# EAGLE schematic CPU-001 (EAGLE 9.5.2)

## Sheet 1 of 6
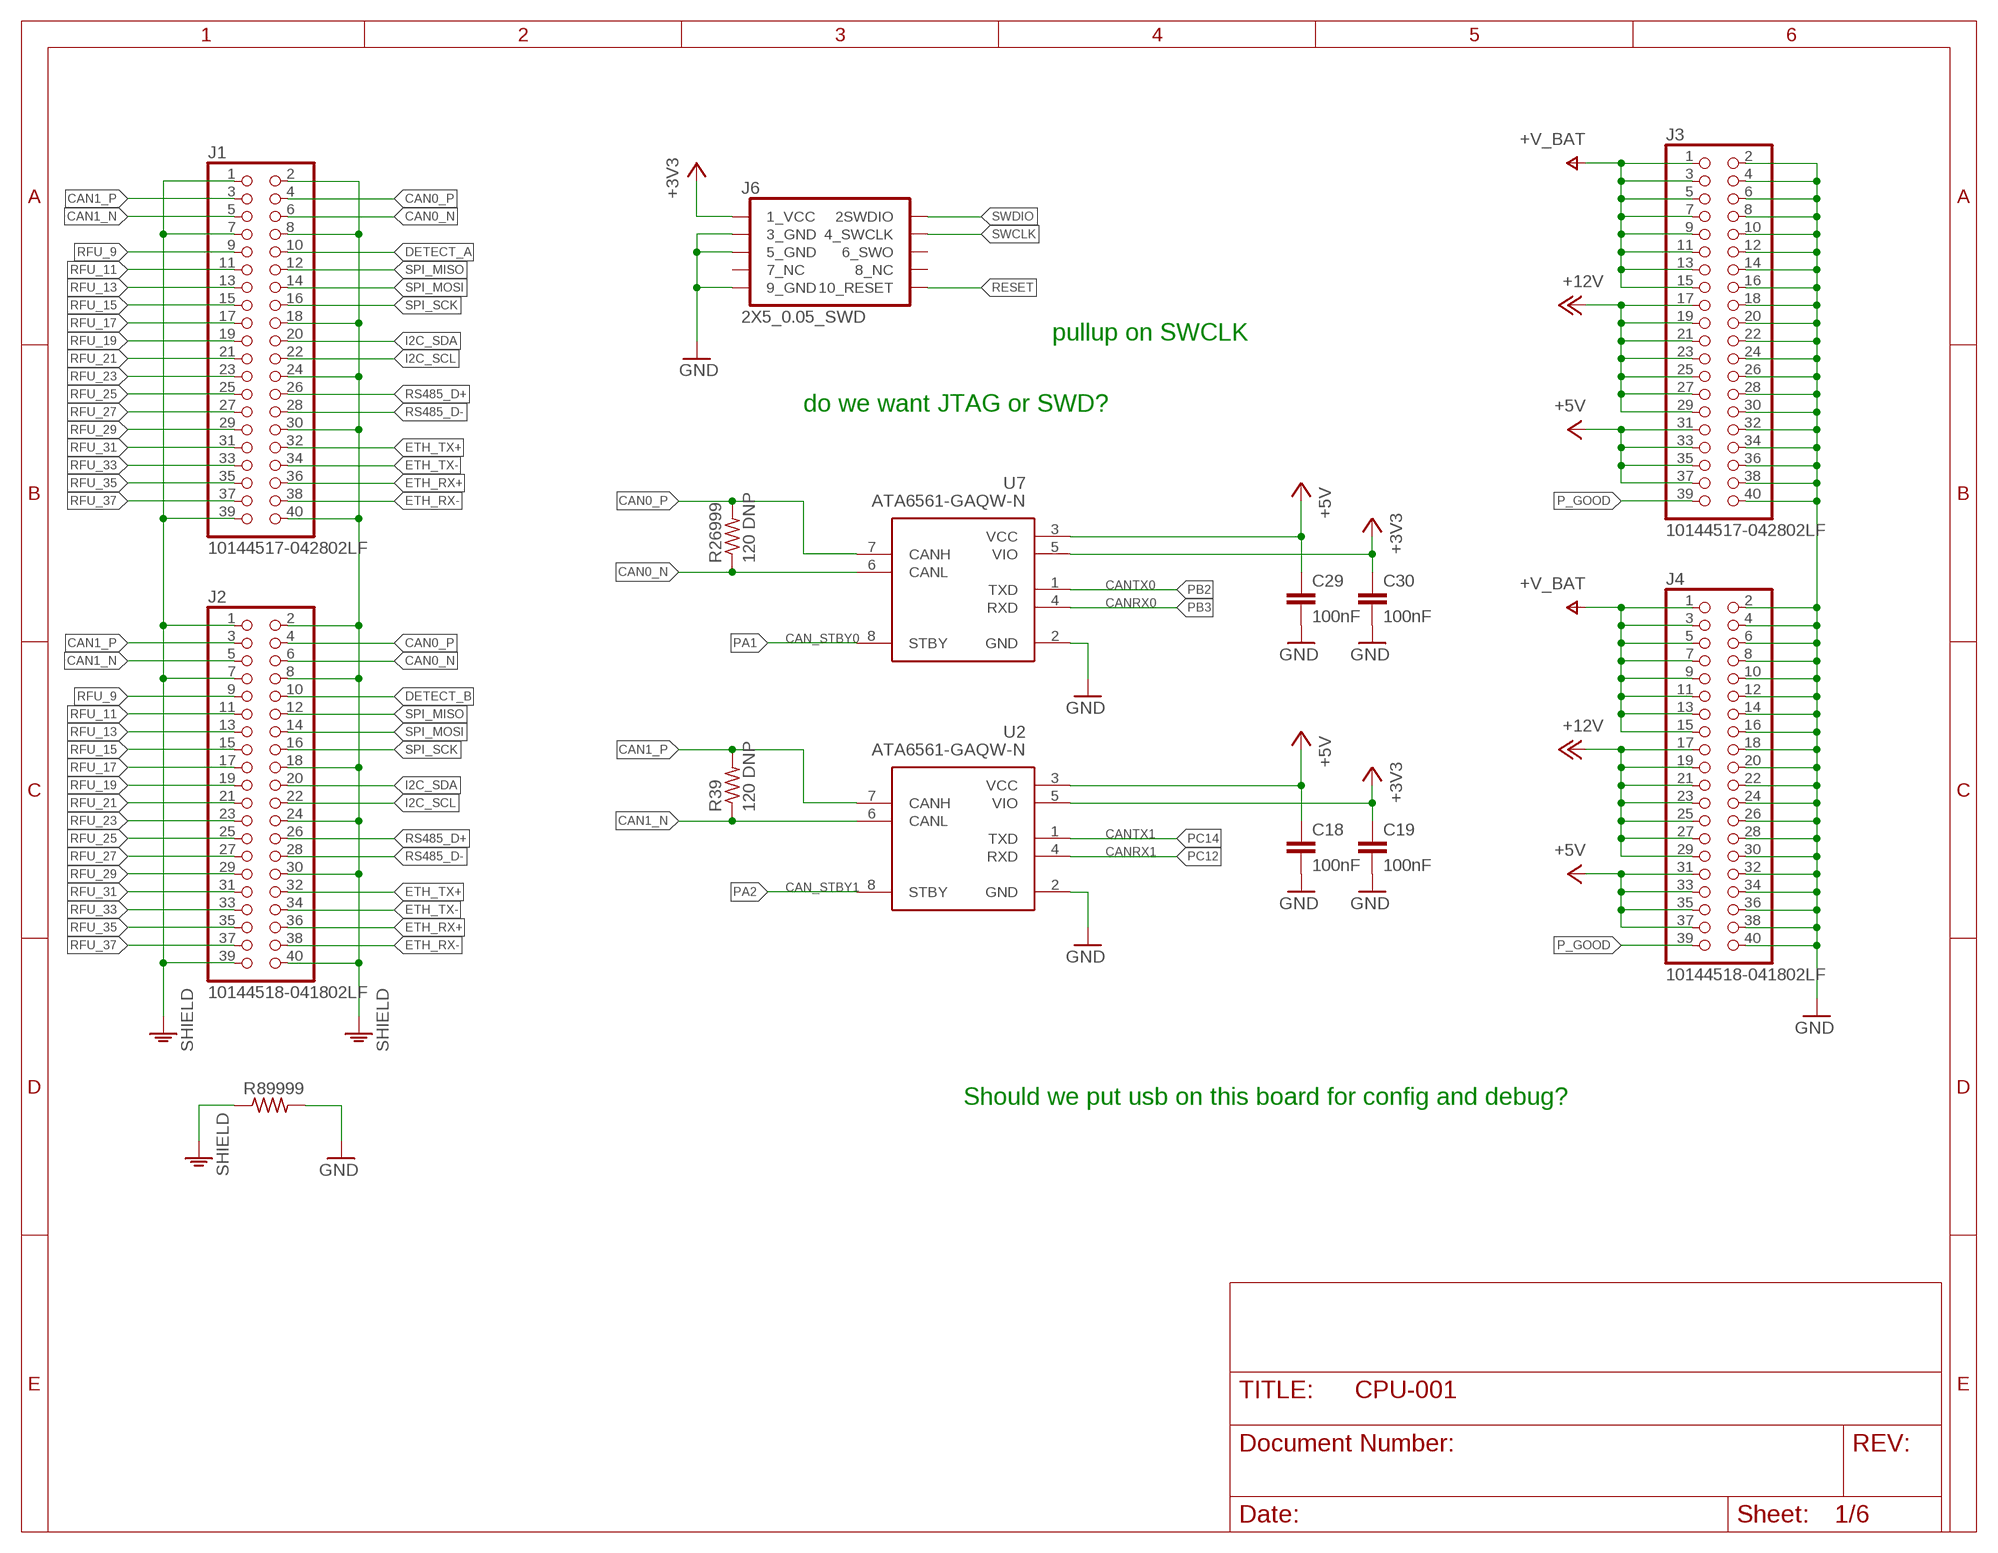
[diagram p0: schematic, sheet 1]

### Parts
C18  100nF  C-EUC0402  [C0402]
C19  100nF  C-EUC0402  [C0402]
C29  100nF  C-EUC0402  [C0402]
C30  100nF  C-EUC0402  [C0402]
J1  10144517-042802LF  [10144517-042802LF]
J2  10144518-041802LF  [10144518-041802LF]
J3  10144517-042802LF  [10144517-042802LF]
J4  10144518-041802LF  [10144518-041802LF]
J6  2X5_0.05_SWD  [2X5_RIGHT]
R39  120 DNP  R-US_R0402  [R0402]
R26999  120 DNP  R-US_R0402  [R0402]
R89999  R-US_R0402  [R0402]
U2  ATA6561-GAQW-N  [SOIC127P600X175-8N]
U7  ATA6561-GAQW-N  [SOIC127P600X175-8N]

### Nets
+3V3: C19.1 C30.1 J6.1(1_VCC) U2.5(VIO) U7.5(VIO) ; also sheet 2,4,5,6
+5V: C18.1 C29.1 J3.31 J3.33 J3.35 J3.37 J4.31 J4.33 J4.35 J4.37 U2.3(VCC) U7.3(VCC) ; also sheet 2
+12V: J3.17 J3.19 J3.21 J3.23 J3.25 J3.27 J3.29 J4.17 J4.19 J4.21 J4.23 J4.25 J4.27 J4.29
+V_BAT: J3.1 J3.3 J3.5 J3.7 J3.9 J3.11 J3.13 J3.15 J4.1 J4.3 J4.5 J4.7 J4.9 J4.11 J4.13 J4.15
CAN0_N: J1.6 J2.6 R26999.1 U7.6(CANL)
CAN0_P: J1.4 J2.4 R26999.2 U7.7(CANH)
CAN1_N: J1.5 J2.5 R39.1 U2.6(CANL)
CAN1_P: J1.3 J2.3 R39.2 U2.7(CANH)
DETECT_A: J1.10
DETECT_B: J2.10
ETH_RX+: J1.36 J2.36
ETH_RX-: J1.38 J2.38
ETH_TX+: J1.32 J2.32
ETH_TX-: J1.34 J2.34
GND: C18.2 C19.2 C29.2 C30.2 J3.2 J3.4 J3.6 J3.8 J3.10 J3.12 J3.14 J3.16 J3.18 J3.20 J3.22 J3.24 J3.26 J3.28 J3.30 J3.32 J3.34 J3.36 J3.38 J3.40 J4.2 J4.4 J4.6 J4.8 J4.10 J4.12 J4.14 J4.16 J4.18 J4.20 J4.22 J4.24 J4.26 J4.28 J4.30 J4.32 J4.34 J4.36 J4.38 J4.40 J6.3(3_GND) J6.5(5_GND) J6.9(9_GND) R89999.2 U2.2(GND) U7.2(GND) ; also sheet 2,4,5,6
I2C_SCL: J1.22 J2.22
I2C_SDA: J1.20 J2.20
P_GOOD: J3.39 J4.39
PA1: U7.8(STBY) ; also sheet 3
PA2: U2.8(STBY) ; also sheet 3
PB2: U7.1(TXD) ; also sheet 3
PB3: U7.4(RXD) ; also sheet 3
PC12: U2.4(RXD) ; also sheet 3
PC14: U2.1(TXD) ; also sheet 3
RESET: J6.10(10_RESET)
RFU_9: J1.9 J2.9
RFU_11: J1.11 J2.11
RFU_13: J1.13 J2.13
RFU_15: J1.15 J2.15
RFU_17: J1.17 J2.17
RFU_19: J1.19 J2.19
RFU_21: J1.21 J2.21
RFU_23: J1.23 J2.23
RFU_25: J1.25 J2.25
RFU_27: J1.27 J2.27
RFU_29: J1.29 J2.29
RFU_31: J1.31 J2.31
RFU_33: J1.33 J2.33
RFU_35: J1.35 J2.35
RFU_37: J1.37 J2.37
RS485_D+: J1.26 J2.26
RS485_D-: J1.28 J2.28
SHIELD: J1.1 J1.2 J1.7 J1.8 J1.18 J1.24 J1.30 J1.39 J1.40 J2.1 J2.2 J2.7 J2.8 J2.18 J2.24 J2.30 J2.39 J2.40 R89999.1
SPI_MISO: J1.12 J2.12
SPI_MOSI: J1.14 J2.14
SPI_SCK: J1.16 J2.16
SWCLK: J6.4(4_SWCLK)
SWDIO: J6.2(2SWDIO)
Unconnected: J6.6(6_SWO) J6.7(7_NC) J6.8(8_NC)

### Notes on the sheet
- pullup on SWCLK
- do we want JTAG or SWD?
- CANTX0
- CANRX0
- CAN_STBY0
- CANTX1
- CANRX1
- CAN_STBY1
- Should we put usb on this board for config and debug?

## Sheet 2 of 6
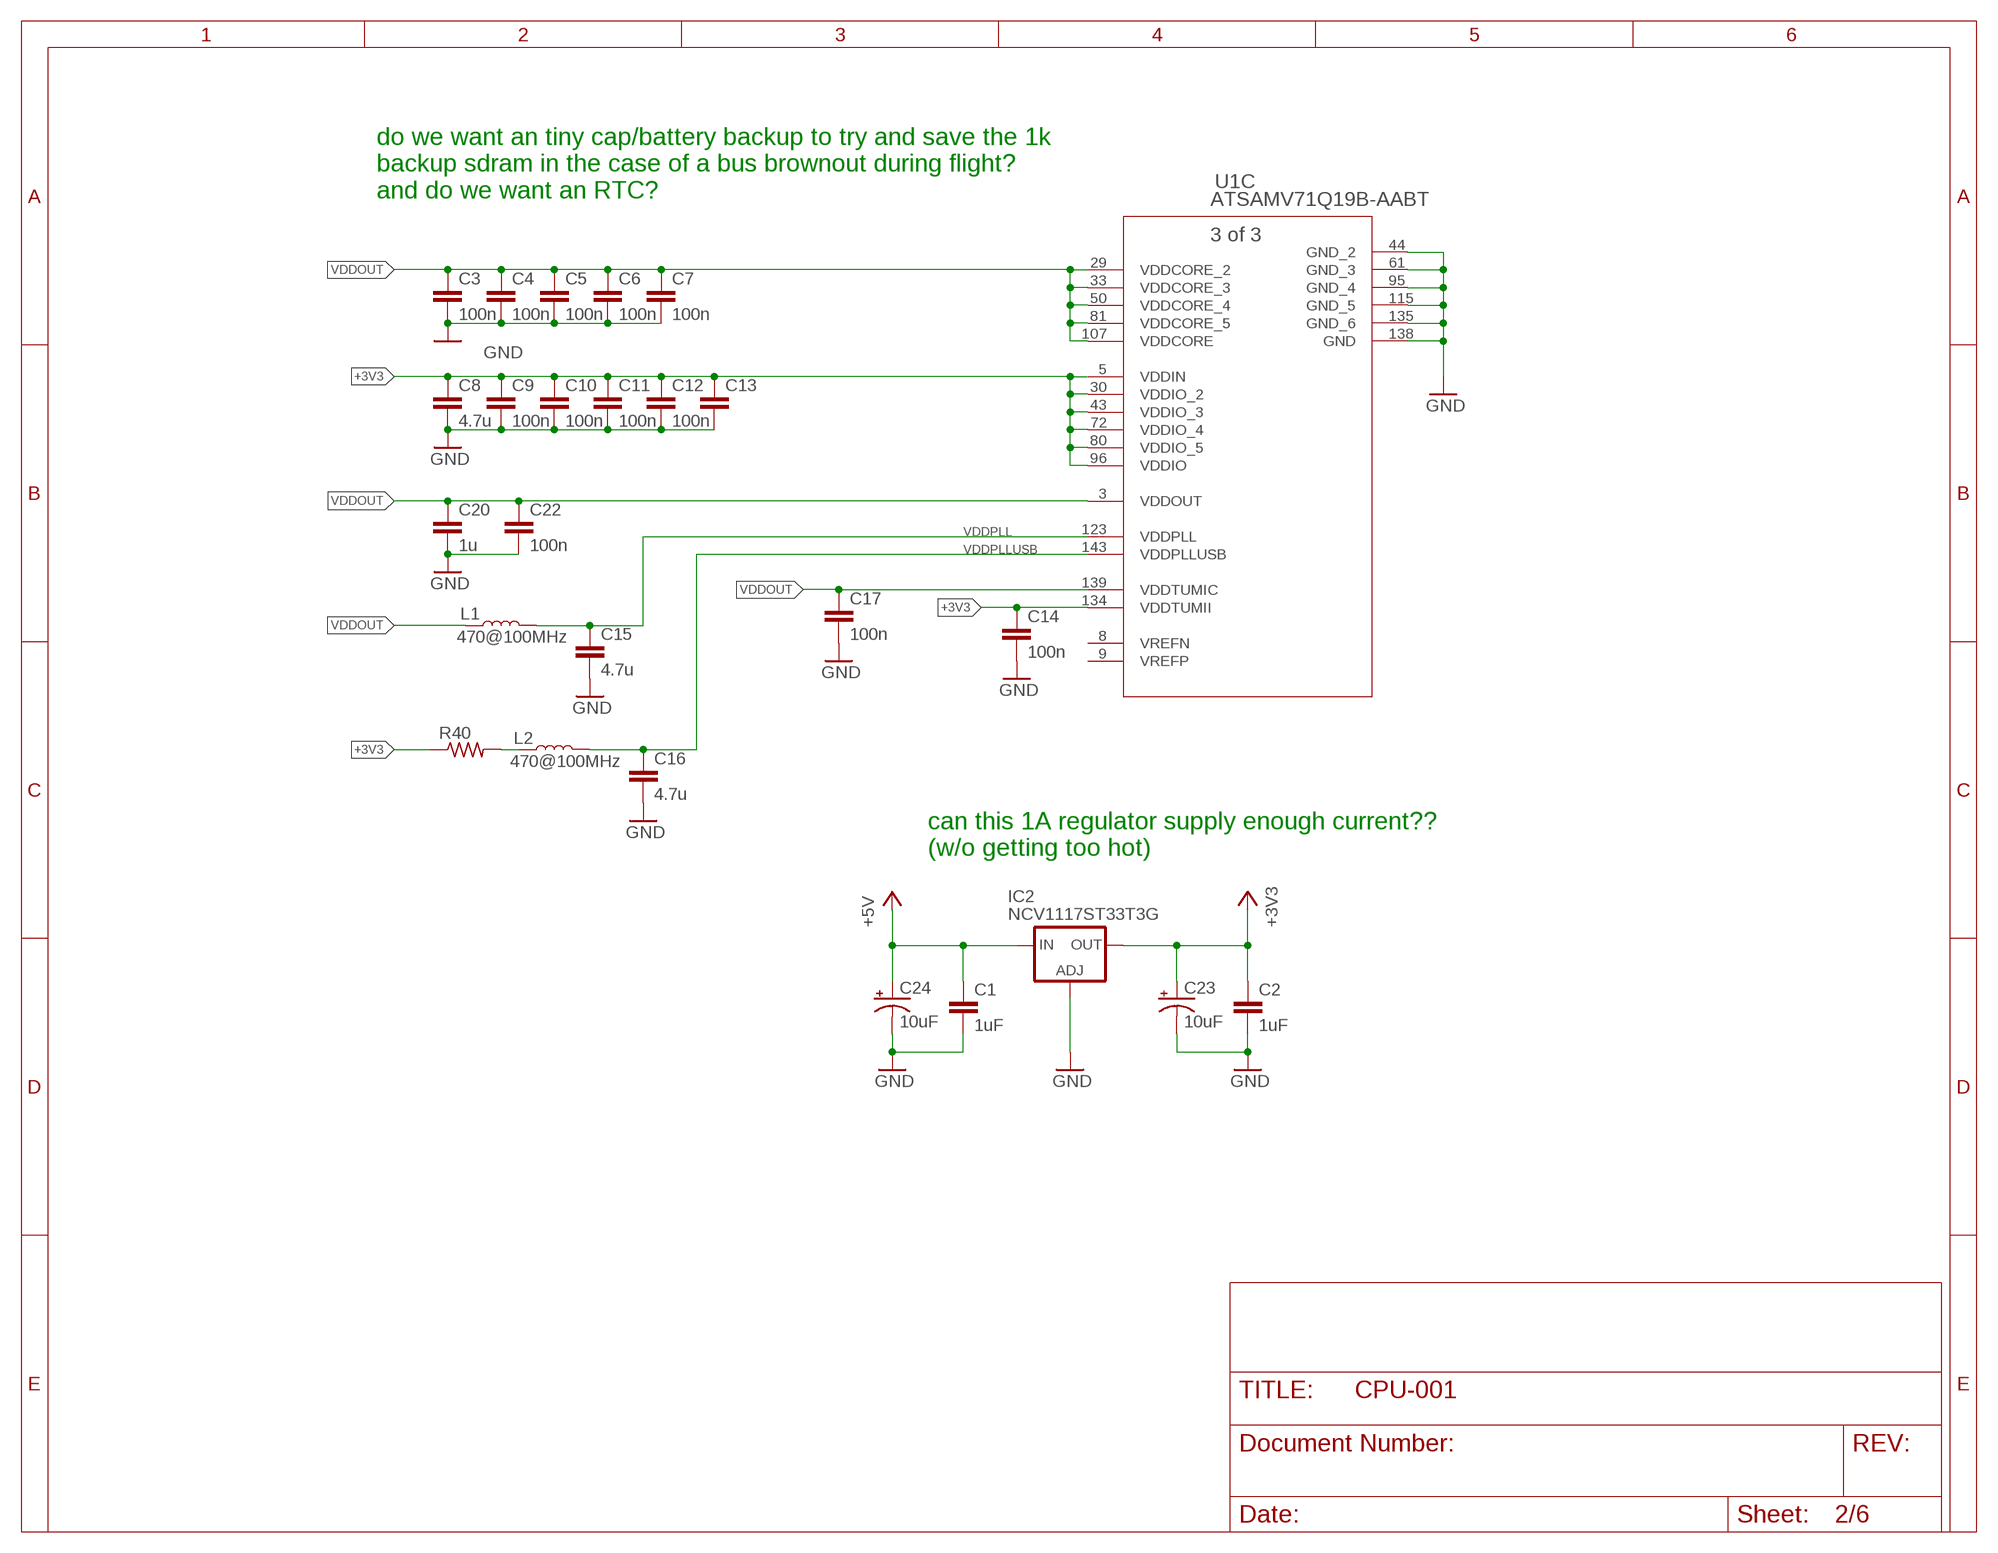
[diagram p1: schematic, sheet 2]

### Parts
C1  1uF  C-EUC0603  [C0603]
C2  1uF  C-EUC0603  [C0603]
C3  100n  C-EUC0402  [C0402]
C4  100n  C-EUC0402  [C0402]
C5  100n  C-EUC0402  [C0402]
C6  100n  C-EUC0402  [C0402]
C7  100n  C-EUC0402  [C0402]
C8  4.7u  C-EUC0805  [C0805]
C9  100n  C-EUC0402  [C0402]
C10  100n  C-EUC0402  [C0402]
C11  100n  C-EUC0402  [C0402]
C12  100n  C-EUC0402  [C0402]
C13  100n  C-EUC0402  [C0402]
C14  100n  C-EUC0402  [C0402]
C15  4.7u  C-EUC0805  [C0805]
C16  4.7u  C-EUC0805  [C0805]
C17  100n  C-EUC0402  [C0402]
C20  1u  C-EUC0402  [C0402]
C22  100n  C-EUC0402  [C0402]
C23  10uF  10UF-POLAR-0603-6.3V-20%(TANT)  [0603-POLAR]
C24  10uF  10UF-POLAR-0603-6.3V-20%(TANT)  [0603-POLAR]
IC2  NCV1117ST33T3G  LD117ASTR  [SOT223]
L1  470@100MHz  INDUCTOR-0603-33NH  [0603]
L2  470@100MHz  INDUCTOR-0603-33NH  [0603]
R40  R-US_R0402  [R0402]
U1  ATSAMV71Q19B-AABT  [LQFP144_20X20MC]

### Nets
+3V3: C2.1 C8.1 C9.1 C10.1 C11.1 C12.1 C13.1 C14.1 C23.+ IC2.4(OUT) R40.1 U1.5(C:VDDIN) U1.30(C:VDDIO_2) U1.43(C:VDDIO_3) U1.72(C:VDDIO_4) U1.80(C:VDDIO_5) U1.96(C:VDDIO) U1.134(C:VDDTUMII) ; also sheet 1,4,5,6
+5V: C1.1 C24.+ IC2.3(IN) ; also sheet 1
GND: C1.2 C2.2 C3.2 C4.2 C5.2 C6.2 C7.2 C8.2 C9.2 C10.2 C11.2 C12.2 C13.2 C14.2 C15.2 C16.2 C17.2 C20.2 C22.2 C23.- C24.- IC2.1(ADJ) U1.44(C:GND_2) U1.61(C:GND_3) U1.95(C:GND_4) U1.115(C:GND_5) U1.135(C:GND_6) U1.138(C:GND) ; also sheet 1,4,5,6
N$4: L2.1 R40.2
VDDOUT: C3.1 C4.1 C5.1 C6.1 C7.1 C17.1 C20.1 C22.1 L1.1 U1.3(C:VDDOUT) U1.29(C:VDDCORE_2) U1.33(C:VDDCORE_3) U1.50(C:VDDCORE_4) U1.81(C:VDDCORE_5) U1.107(C:VDDCORE) U1.139(C:VDDTUMIC)
VDDPLL: C15.1 L1.2 U1.123(C:VDDPLL)
VDDPLLUSB: C16.1 L2.2 U1.143(C:VDDPLLUSB)

### Notes on the sheet
- do we want an tiny cap/battery backup to try and save the 1k
  backup sdram in the case of a bus brownout during flight?
  and do we want an RTC?
- can this 1A regulator supply enough current?? 
  (w/o getting too hot)

## Sheet 3 of 6
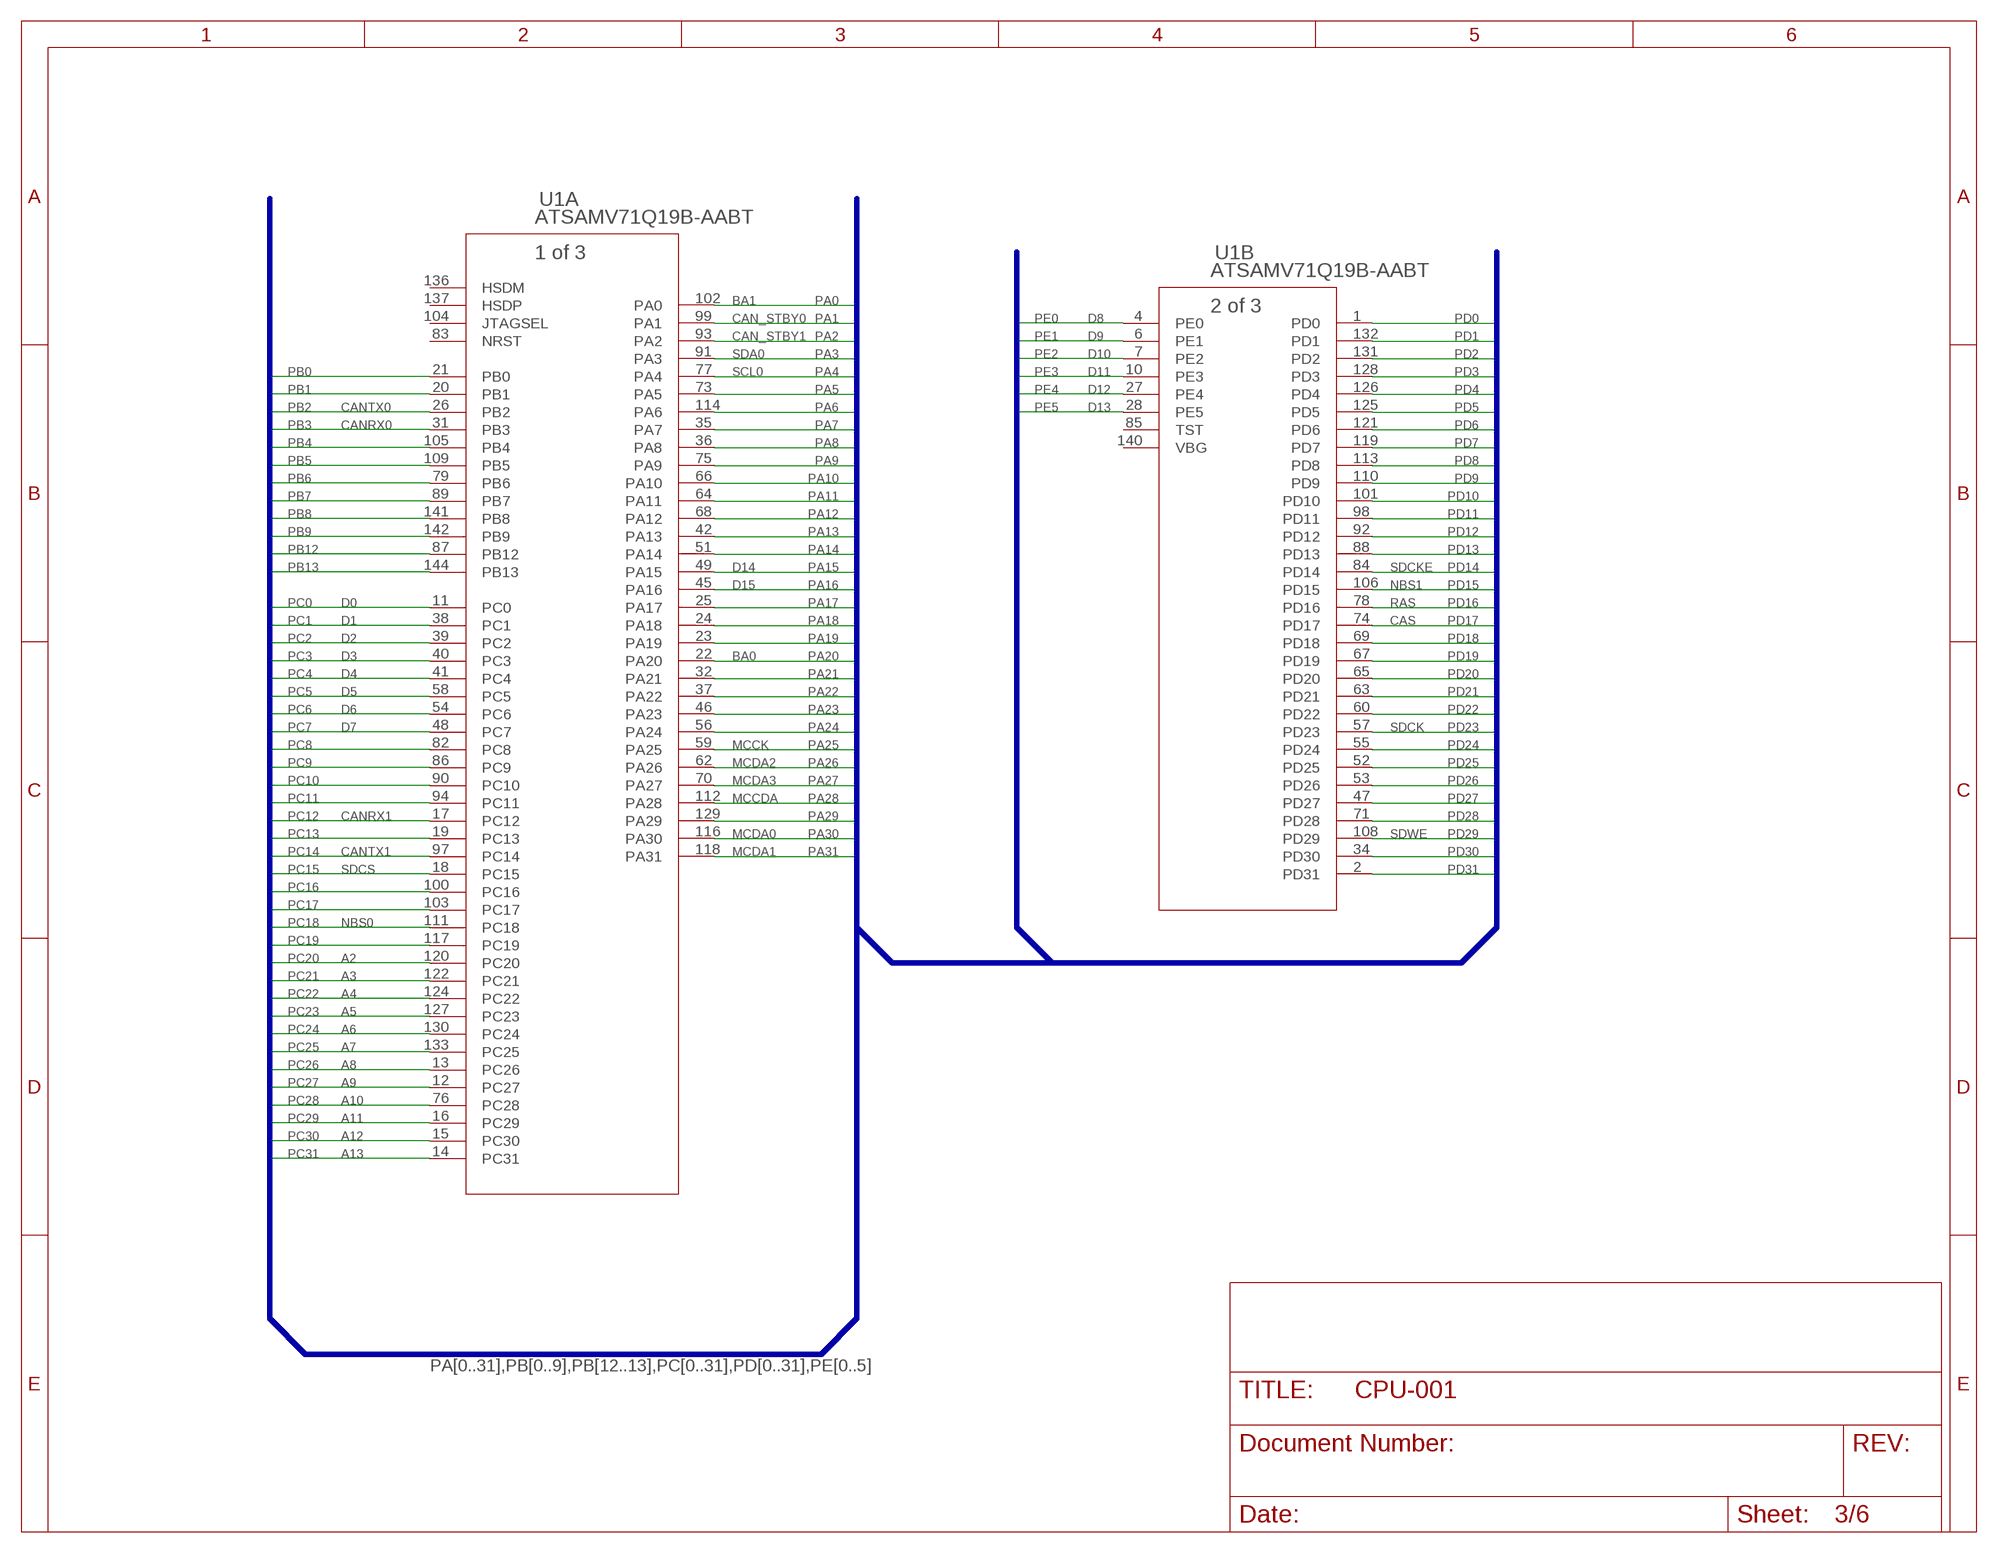
[diagram p2: schematic, sheet 3]

### Nets
PA0: U1.102(A:PA0) ; also sheet 4
PA1: U1.99(A:PA1) ; also sheet 1
PA2: U1.93(A:PA2) ; also sheet 1
PA3: U1.91(A:PA3) ; also sheet 6
PA4: U1.77(A:PA4) ; also sheet 6
PA5: U1.73(A:PA5)
PA6: U1.114(A:PA6)
PA7: U1.35(A:PA7)
PA8: U1.36(A:PA8)
PA9: U1.75(A:PA9)
PA10: U1.66(A:PA10)
PA11: U1.64(A:PA11)
PA12: U1.68(A:PA12)
PA13: U1.42(A:PA13)
PA14: U1.51(A:PA14)
PA15: U1.49(A:PA15) ; also sheet 4
PA16: U1.45(A:PA16) ; also sheet 4
PA17: U1.25(A:PA17)
PA18: U1.24(A:PA18)
PA19: U1.23(A:PA19)
PA20: U1.22(A:PA20) ; also sheet 4
PA21: U1.32(A:PA21)
PA22: U1.37(A:PA22)
PA23: U1.46(A:PA23)
PA24: U1.56(A:PA24)
PA25: U1.59(A:PA25) ; also sheet 5
PA26: U1.62(A:PA26) ; also sheet 5
PA27: U1.70(A:PA27) ; also sheet 5
PA28: U1.112(A:PA28) ; also sheet 5
PA29: U1.129(A:PA29)
PA30: U1.116(A:PA30) ; also sheet 5
PA31: U1.118(A:PA31) ; also sheet 5
PB0: U1.21(A:PB0)
PB1: U1.20(A:PB1)
PB2: U1.26(A:PB2) ; also sheet 1
PB3: U1.31(A:PB3) ; also sheet 1
PB4: U1.105(A:PB4)
PB5: U1.109(A:PB5)
PB6: U1.79(A:PB6)
PB7: U1.89(A:PB7)
PB8: U1.141(A:PB8)
PB9: U1.142(A:PB9)
PB12: U1.87(A:PB12)
PB13: U1.144(A:PB13)
PC0: U1.11(A:PC0) ; also sheet 4
PC1: U1.38(A:PC1) ; also sheet 4
PC2: U1.39(A:PC2) ; also sheet 4
PC3: U1.40(A:PC3) ; also sheet 4
PC4: U1.41(A:PC4) ; also sheet 4
PC5: U1.58(A:PC5) ; also sheet 4
PC6: U1.54(A:PC6) ; also sheet 4
PC7: U1.48(A:PC7) ; also sheet 4
PC8: U1.82(A:PC8)
PC9: U1.86(A:PC9)
PC10: U1.90(A:PC10)
PC11: U1.94(A:PC11)
PC12: U1.17(A:PC12) ; also sheet 1
PC13: U1.19(A:PC13)
PC14: U1.97(A:PC14) ; also sheet 1
PC15: U1.18(A:PC15) ; also sheet 4
PC16: U1.100(A:PC16)
PC17: U1.103(A:PC17)
PC18: U1.111(A:PC18) ; also sheet 4
PC19: U1.117(A:PC19)
PC20: U1.120(A:PC20) ; also sheet 4
PC21: U1.122(A:PC21) ; also sheet 4
PC22: U1.124(A:PC22) ; also sheet 4
PC23: U1.127(A:PC23) ; also sheet 4
PC24: U1.130(A:PC24) ; also sheet 4
PC25: U1.133(A:PC25) ; also sheet 4
PC26: U1.13(A:PC26) ; also sheet 4
PC27: U1.12(A:PC27) ; also sheet 4
PC28: U1.76(A:PC28) ; also sheet 4
PC29: U1.16(A:PC29) ; also sheet 4
PC30: U1.15(A:PC30) ; also sheet 4
PC31: U1.14(A:PC31) ; also sheet 4
PD0: U1.1(B:PD0)
PD1: U1.132(B:PD1)
PD2: U1.131(B:PD2)
PD3: U1.128(B:PD3)
PD4: U1.126(B:PD4)
PD5: U1.125(B:PD5)
PD6: U1.121(B:PD6)
PD7: U1.119(B:PD7)
PD8: U1.113(B:PD8)
PD9: U1.110(B:PD9)
PD10: U1.101(B:PD10)
PD11: U1.98(B:PD11)
PD12: U1.92(B:PD12)
PD13: U1.88(B:PD13)
PD14: U1.84(B:PD14) ; also sheet 4
PD15: U1.106(B:PD15) ; also sheet 4
PD16: U1.78(B:PD16) ; also sheet 4
PD17: U1.74(B:PD17) ; also sheet 4
PD18: U1.69(B:PD18)
PD19: U1.67(B:PD19)
PD20: U1.65(B:PD20)
PD21: U1.63(B:PD21)
PD22: U1.60(B:PD22)
PD23: U1.57(B:PD23) ; also sheet 4
PD24: U1.55(B:PD24)
PD25: U1.52(B:PD25)
PD26: U1.53(B:PD26)
PD27: U1.47(B:PD27)
PD28: U1.71(B:PD28)
PD29: U1.108(B:PD29) ; also sheet 4
PD30: U1.34(B:PD30)
PD31: U1.2(B:PD31)
PE0: U1.4(B:PE0) ; also sheet 4
PE1: U1.6(B:PE1) ; also sheet 4
PE2: U1.7(B:PE2) ; also sheet 4
PE3: U1.10(B:PE3) ; also sheet 4
PE4: U1.27(B:PE4) ; also sheet 4
PE5: U1.28(B:PE5) ; also sheet 4
Unconnected: U1.83(A:NRST) U1.85(B:TST) U1.104(A:JTAGSEL) U1.136(A:HSDM) U1.137(A:HSDP) U1.140(B:VBG)

### Buses
PA[0..31],PB[0..9],PB[12..13],PC[0..31],PD[0..31],PE[0..5]

### Notes on the sheet
- BA1
- CAN_STBY0 | D8
- CAN_STBY1 | D9
- SDA0 | D10
- SCL0 | D11
- D12
- CANTX0 | D13
- CANRX0
- D14 | SDCKE
- D15 | NBS1
- D0 | RAS
- D1 | CAS
- D2
- D3 | BA0
- D4
- D5
- D6
- D7 | SDCK
- MCCK
- MCDA2
- MCDA3
- MCCDA
- CANRX1
- MCDA0 | SDWE
- CANTX1 | MCDA1
- SDCS
- NBS0
- A2
- A3
- A4
- A5
- A6
- A7
- A8
- A9
- A10
- A11
- A12
- A13

## Sheet 4 of 6
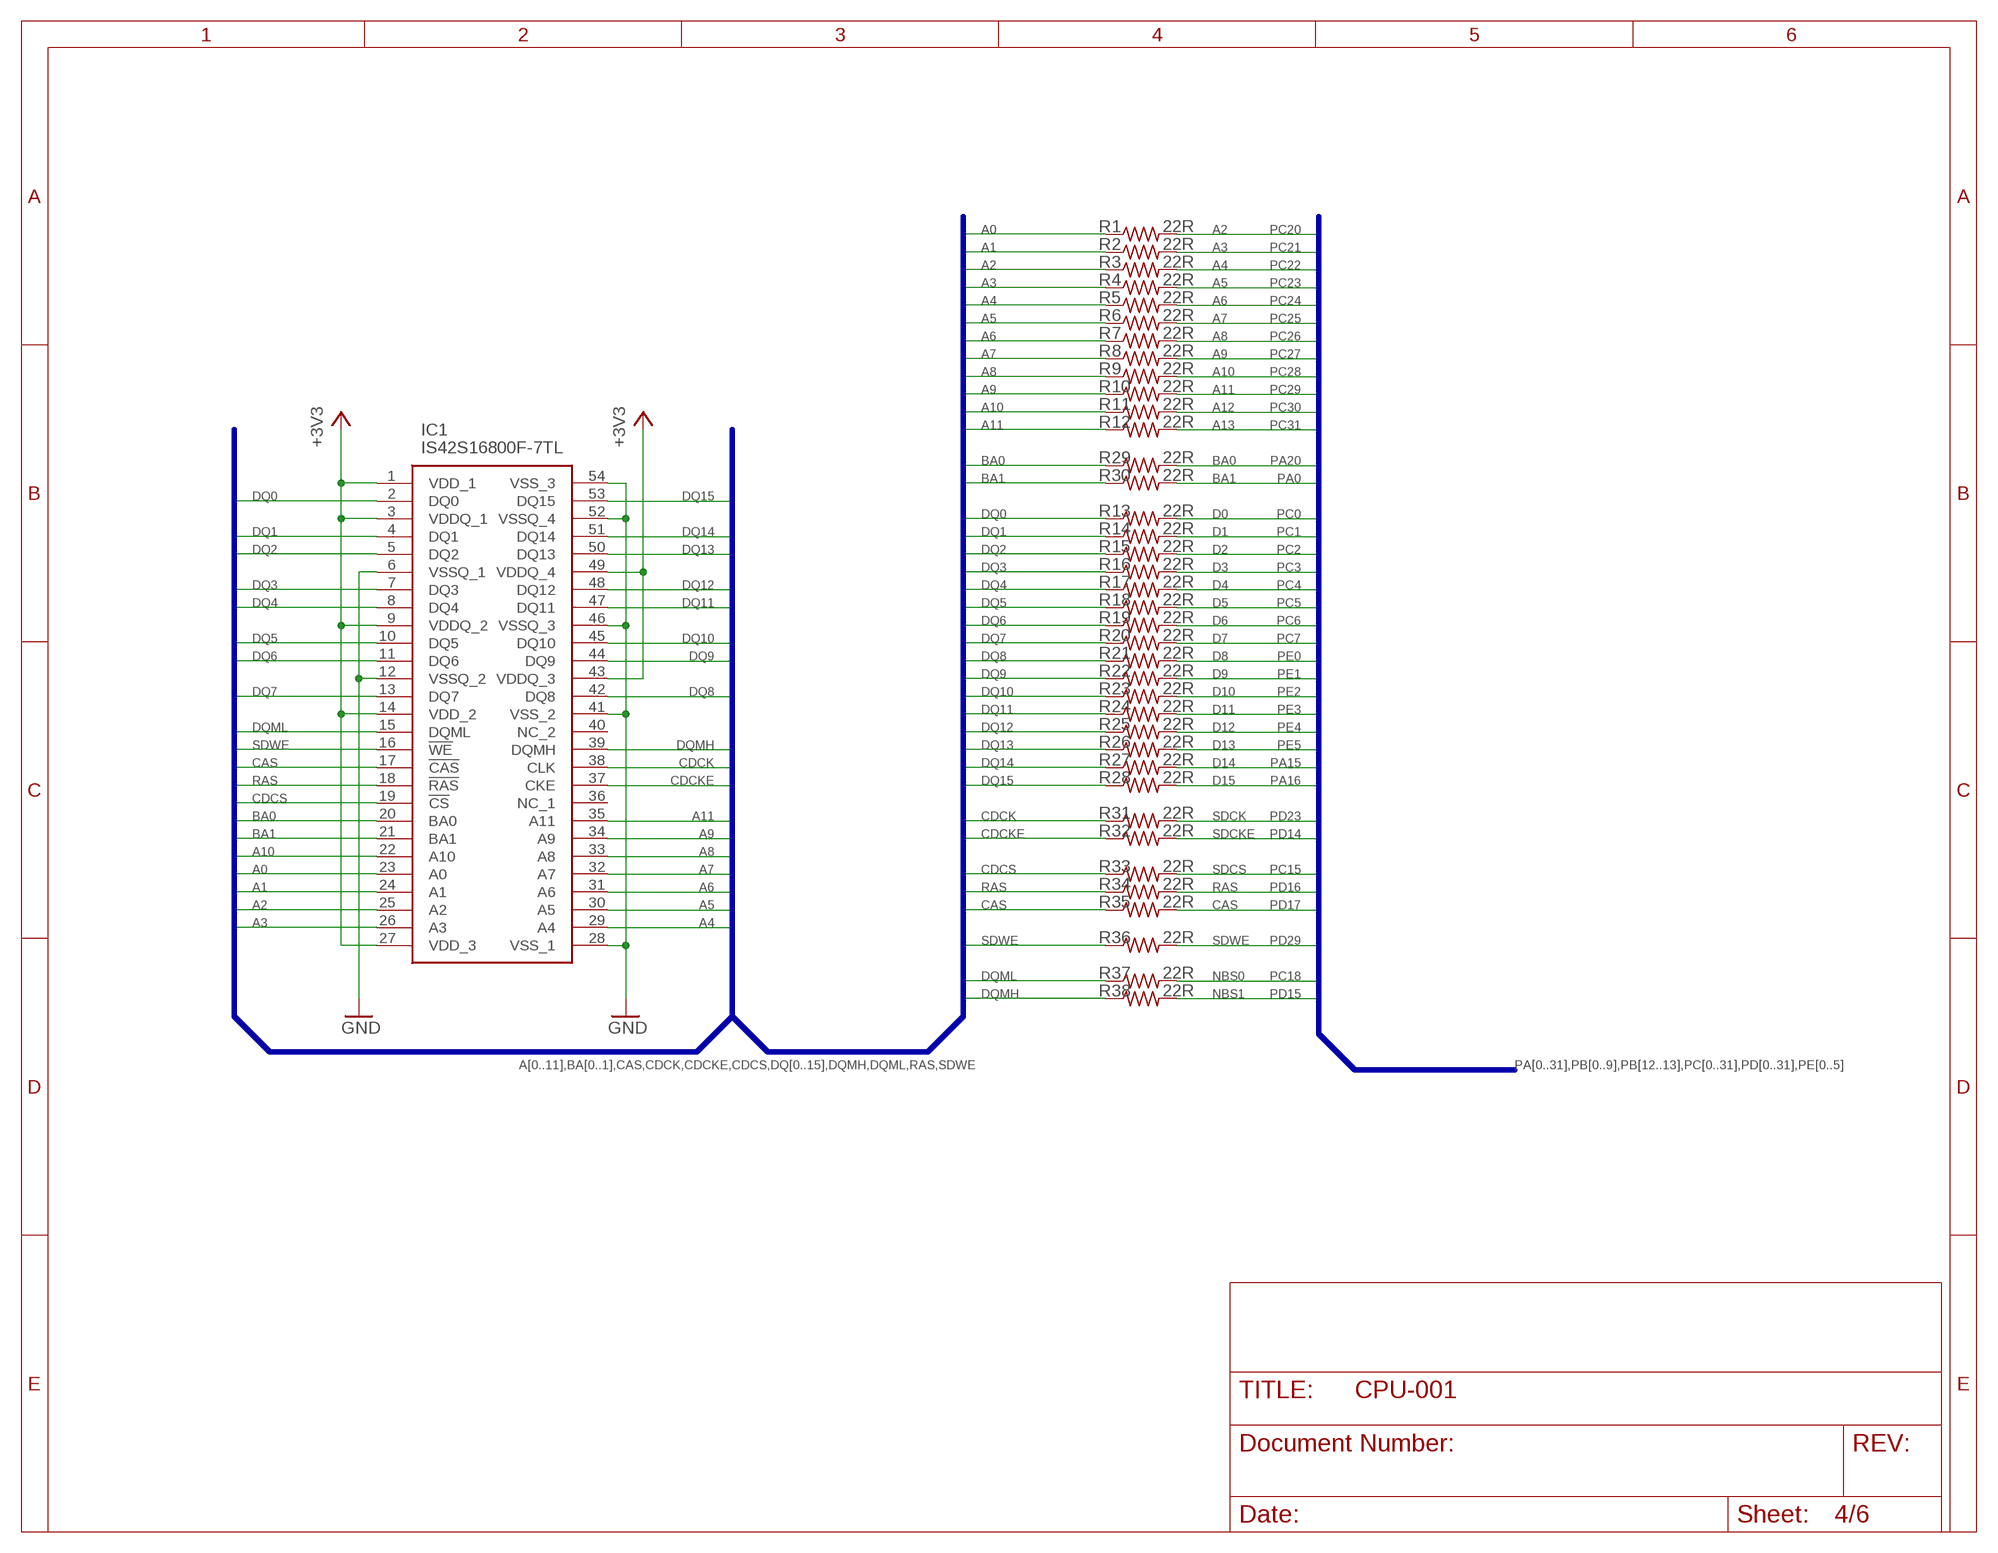
[diagram p3: schematic, sheet 4]

### Parts
IC1  IS42S16800F-7TL  [SOP80P1176X120-54N]
R1  22R  R-US_R0402  [R0402]
R2  22R  R-US_R0402  [R0402]
R3  22R  R-US_R0402  [R0402]
R4  22R  R-US_R0402  [R0402]
R5  22R  R-US_R0402  [R0402]
R6  22R  R-US_R0402  [R0402]
R7  22R  R-US_R0402  [R0402]
R8  22R  R-US_R0402  [R0402]
R9  22R  R-US_R0402  [R0402]
R10  22R  R-US_R0402  [R0402]
R11  22R  R-US_R0402  [R0402]
R12  22R  R-US_R0402  [R0402]
R13  22R  R-US_R0402  [R0402]
R14  22R  R-US_R0402  [R0402]
R15  22R  R-US_R0402  [R0402]
R16  22R  R-US_R0402  [R0402]
R17  22R  R-US_R0402  [R0402]
R18  22R  R-US_R0402  [R0402]
R19  22R  R-US_R0402  [R0402]
R20  22R  R-US_R0402  [R0402]
R21  22R  R-US_R0402  [R0402]
R22  22R  R-US_R0402  [R0402]
R23  22R  R-US_R0402  [R0402]
R24  22R  R-US_R0402  [R0402]
R25  22R  R-US_R0402  [R0402]
R26  22R  R-US_R0402  [R0402]
R27  22R  R-US_R0402  [R0402]
R28  22R  R-US_R0402  [R0402]
R29  22R  R-US_R0402  [R0402]
R30  22R  R-US_R0402  [R0402]
R31  22R  R-US_R0402  [R0402]
R32  22R  R-US_R0402  [R0402]
R33  22R  R-US_R0402  [R0402]
R34  22R  R-US_R0402  [R0402]
R35  22R  R-US_R0402  [R0402]
R36  22R  R-US_R0402  [R0402]
R37  22R  R-US_R0402  [R0402]
R38  22R  R-US_R0402  [R0402]

### Nets
+3V3: IC1.1(VDD_1) IC1.3(VDDQ_1) IC1.9(VDDQ_2) IC1.14(VDD_2) IC1.27(VDD_3) IC1.43(VDDQ_3) IC1.49(VDDQ_4) ; also sheet 1,2,5,6
A0: IC1.23(A0) R1.1
A1: IC1.24(A1) R2.1
A2: IC1.25(A2) R3.1
A3: IC1.26(A3) R4.1
A4: IC1.29(A4) R5.1
A5: IC1.30(A5) R6.1
A6: IC1.31(A6) R7.1
A7: IC1.32(A7) R8.1
A8: IC1.33(A8) R9.1
A9: IC1.34(A9) R10.1
A10: IC1.22(A10) R11.1
A11: IC1.35(A11) R12.1
BA0: IC1.20(BA0) R29.1
BA1: IC1.21(BA1) R30.1
CAS: IC1.17(!CAS) R35.1
CDCK: IC1.38(CLK) R31.1
CDCKE: IC1.37(CKE) R32.1
CDCS: IC1.19(!CS) R33.1
DQ0: IC1.2(DQ0) R13.1
DQ1: IC1.4(DQ1) R14.1
DQ2: IC1.5(DQ2) R15.1
DQ3: IC1.7(DQ3) R16.1
DQ4: IC1.8(DQ4) R17.1
DQ5: IC1.10(DQ5) R18.1
DQ6: IC1.11(DQ6) R19.1
DQ7: IC1.13(DQ7) R20.1
DQ8: IC1.42(DQ8) R21.1
DQ9: IC1.44(DQ9) R22.1
DQ10: IC1.45(DQ10) R23.1
DQ11: IC1.47(DQ11) R24.1
DQ12: IC1.48(DQ12) R25.1
DQ13: IC1.50(DQ13) R26.1
DQ14: IC1.51(DQ14) R27.1
DQ15: IC1.53(DQ15) R28.1
DQMH: IC1.39(DQMH) R38.1
DQML: IC1.15(DQML) R37.1
GND: IC1.6(VSSQ_1) IC1.12(VSSQ_2) IC1.28(VSS_1) IC1.41(VSS_2) IC1.46(VSSQ_3) IC1.52(VSSQ_4) IC1.54(VSS_3) ; also sheet 1,2,5,6
PA0: R30.2 ; also sheet 3
PA15: R27.2 ; also sheet 3
PA16: R28.2 ; also sheet 3
PA20: R29.2 ; also sheet 3
PC0: R13.2 ; also sheet 3
PC1: R14.2 ; also sheet 3
PC2: R15.2 ; also sheet 3
PC3: R16.2 ; also sheet 3
PC4: R17.2 ; also sheet 3
PC5: R18.2 ; also sheet 3
PC6: R19.2 ; also sheet 3
PC7: R20.2 ; also sheet 3
PC15: R33.2 ; also sheet 3
PC18: R37.2 ; also sheet 3
PC20: R1.2 ; also sheet 3
PC21: R2.2 ; also sheet 3
PC22: R3.2 ; also sheet 3
PC23: R4.2 ; also sheet 3
PC24: R5.2 ; also sheet 3
PC25: R6.2 ; also sheet 3
PC26: R7.2 ; also sheet 3
PC27: R8.2 ; also sheet 3
PC28: R9.2 ; also sheet 3
PC29: R10.2 ; also sheet 3
PC30: R11.2 ; also sheet 3
PC31: R12.2 ; also sheet 3
PD14: R32.2 ; also sheet 3
PD15: R38.2 ; also sheet 3
PD16: R34.2 ; also sheet 3
PD17: R35.2 ; also sheet 3
PD23: R31.2 ; also sheet 3
PD29: R36.2 ; also sheet 3
PE0: R21.2 ; also sheet 3
PE1: R22.2 ; also sheet 3
PE2: R23.2 ; also sheet 3
PE3: R24.2 ; also sheet 3
PE4: R25.2 ; also sheet 3
PE5: R26.2 ; also sheet 3
RAS: IC1.18(!RAS) R34.1
SDWE: IC1.16(!WE) R36.1
Unconnected: IC1.36(NC_1) IC1.40(NC_2)

### Buses
A[0..11],BA[0..1],CAS,CDCK,CDCKE,CDCS,DQ[0..15],DQMH,DQML,RAS,SDWE
PA[0..31],PB[0..9],PB[12..13],PC[0..31],PD[0..31],PE[0..5]

### Notes on the sheet
- A2
- A3
- A4
- A5
- A6
- A7
- A8
- A9
- A10
- A11
- A12
- A13
- BA0
- BA1
- D0
- D1
- D2
- D3
- D4
- D5
- D6
- D7
- D8
- D9
- D10
- D11
- D12
- D13
- D14
- D15
- SDCK
- SDCKE
- SDCS
- RAS
- CAS
- SDWE
- NBS0
- NBS1

## Sheet 5 of 6
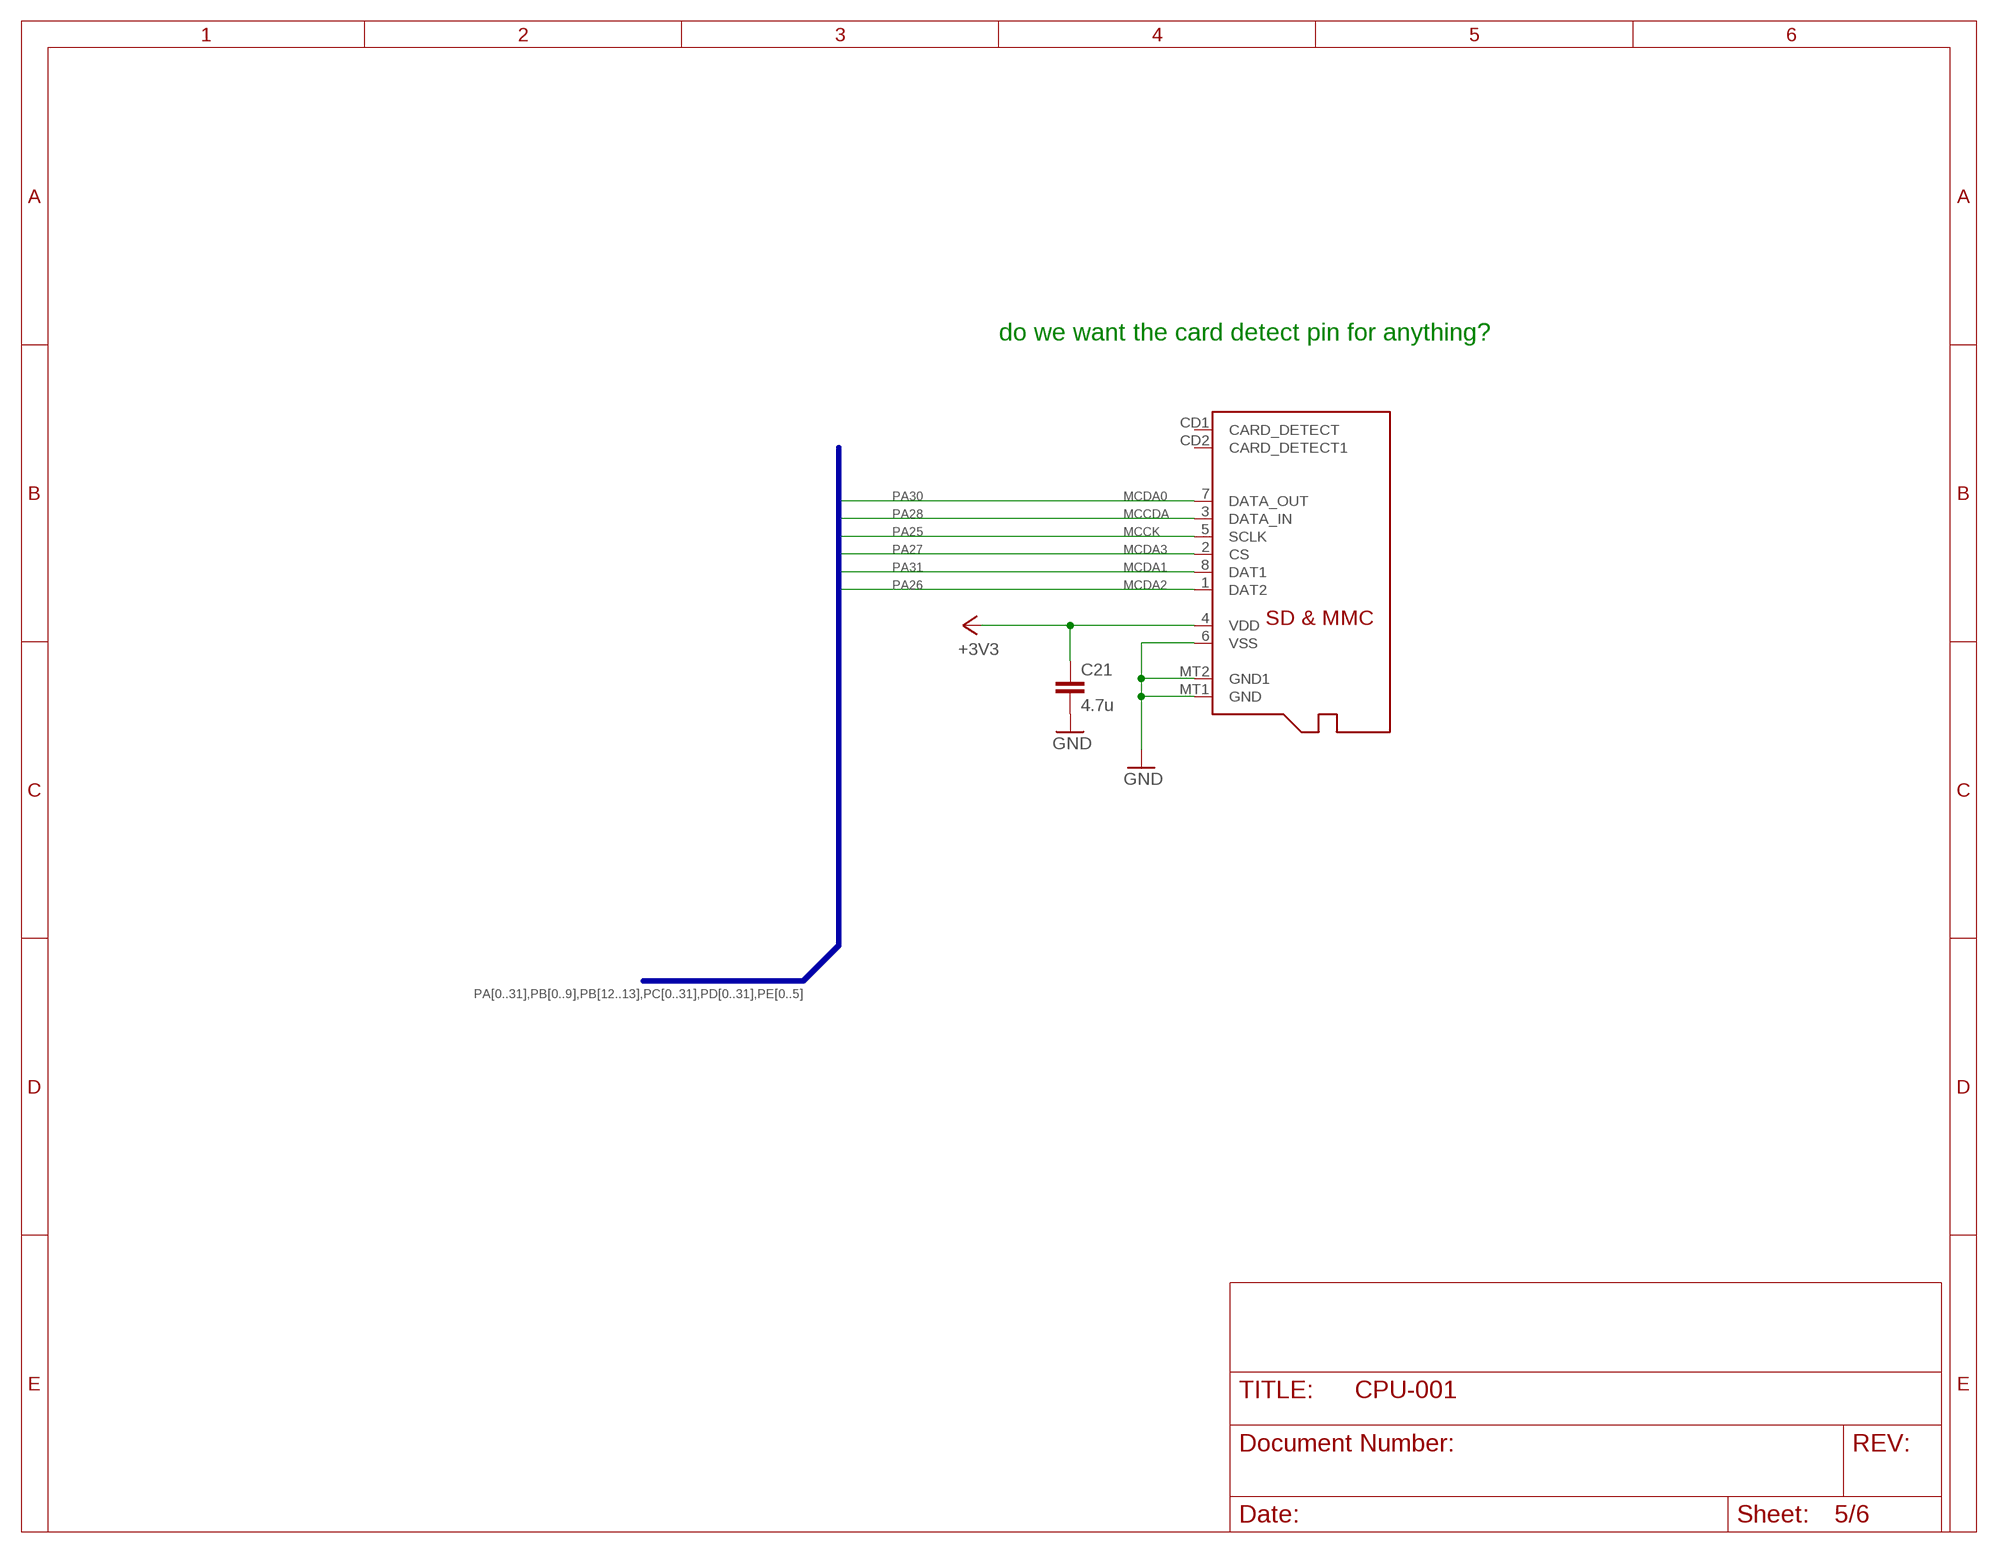
[diagram p4: schematic, sheet 5]

### Parts
C21  4.7u  C-EUC0805  [C0805]
U$5  MICROSD  [MICROSD_]

### Nets
+3V3: C21.1 U$5.4(VDD) ; also sheet 1,2,4,6
GND: C21.2 U$5.6(VSS) U$5.MT1(GND) U$5.MT2(GND1) ; also sheet 1,2,4,6
PA25: U$5.5(SCLK) ; also sheet 3
PA26: U$5.1(DAT2) ; also sheet 3
PA27: U$5.2(CS) ; also sheet 3
PA28: U$5.3(DATA_IN) ; also sheet 3
PA30: U$5.7(DATA_OUT) ; also sheet 3
PA31: U$5.8(DAT1) ; also sheet 3
Unconnected: U$5.CD1(CARD_DETECT) U$5.CD2(CARD_DETECT1)

### Buses
PA[0..31],PB[0..9],PB[12..13],PC[0..31],PD[0..31],PE[0..5]

### Notes on the sheet
- do we want the card detect pin for anything?
- MCDA0
- MCCDA
- MCCK
- MCDA3
- MCDA1
- MCDA2

## Sheet 6 of 6
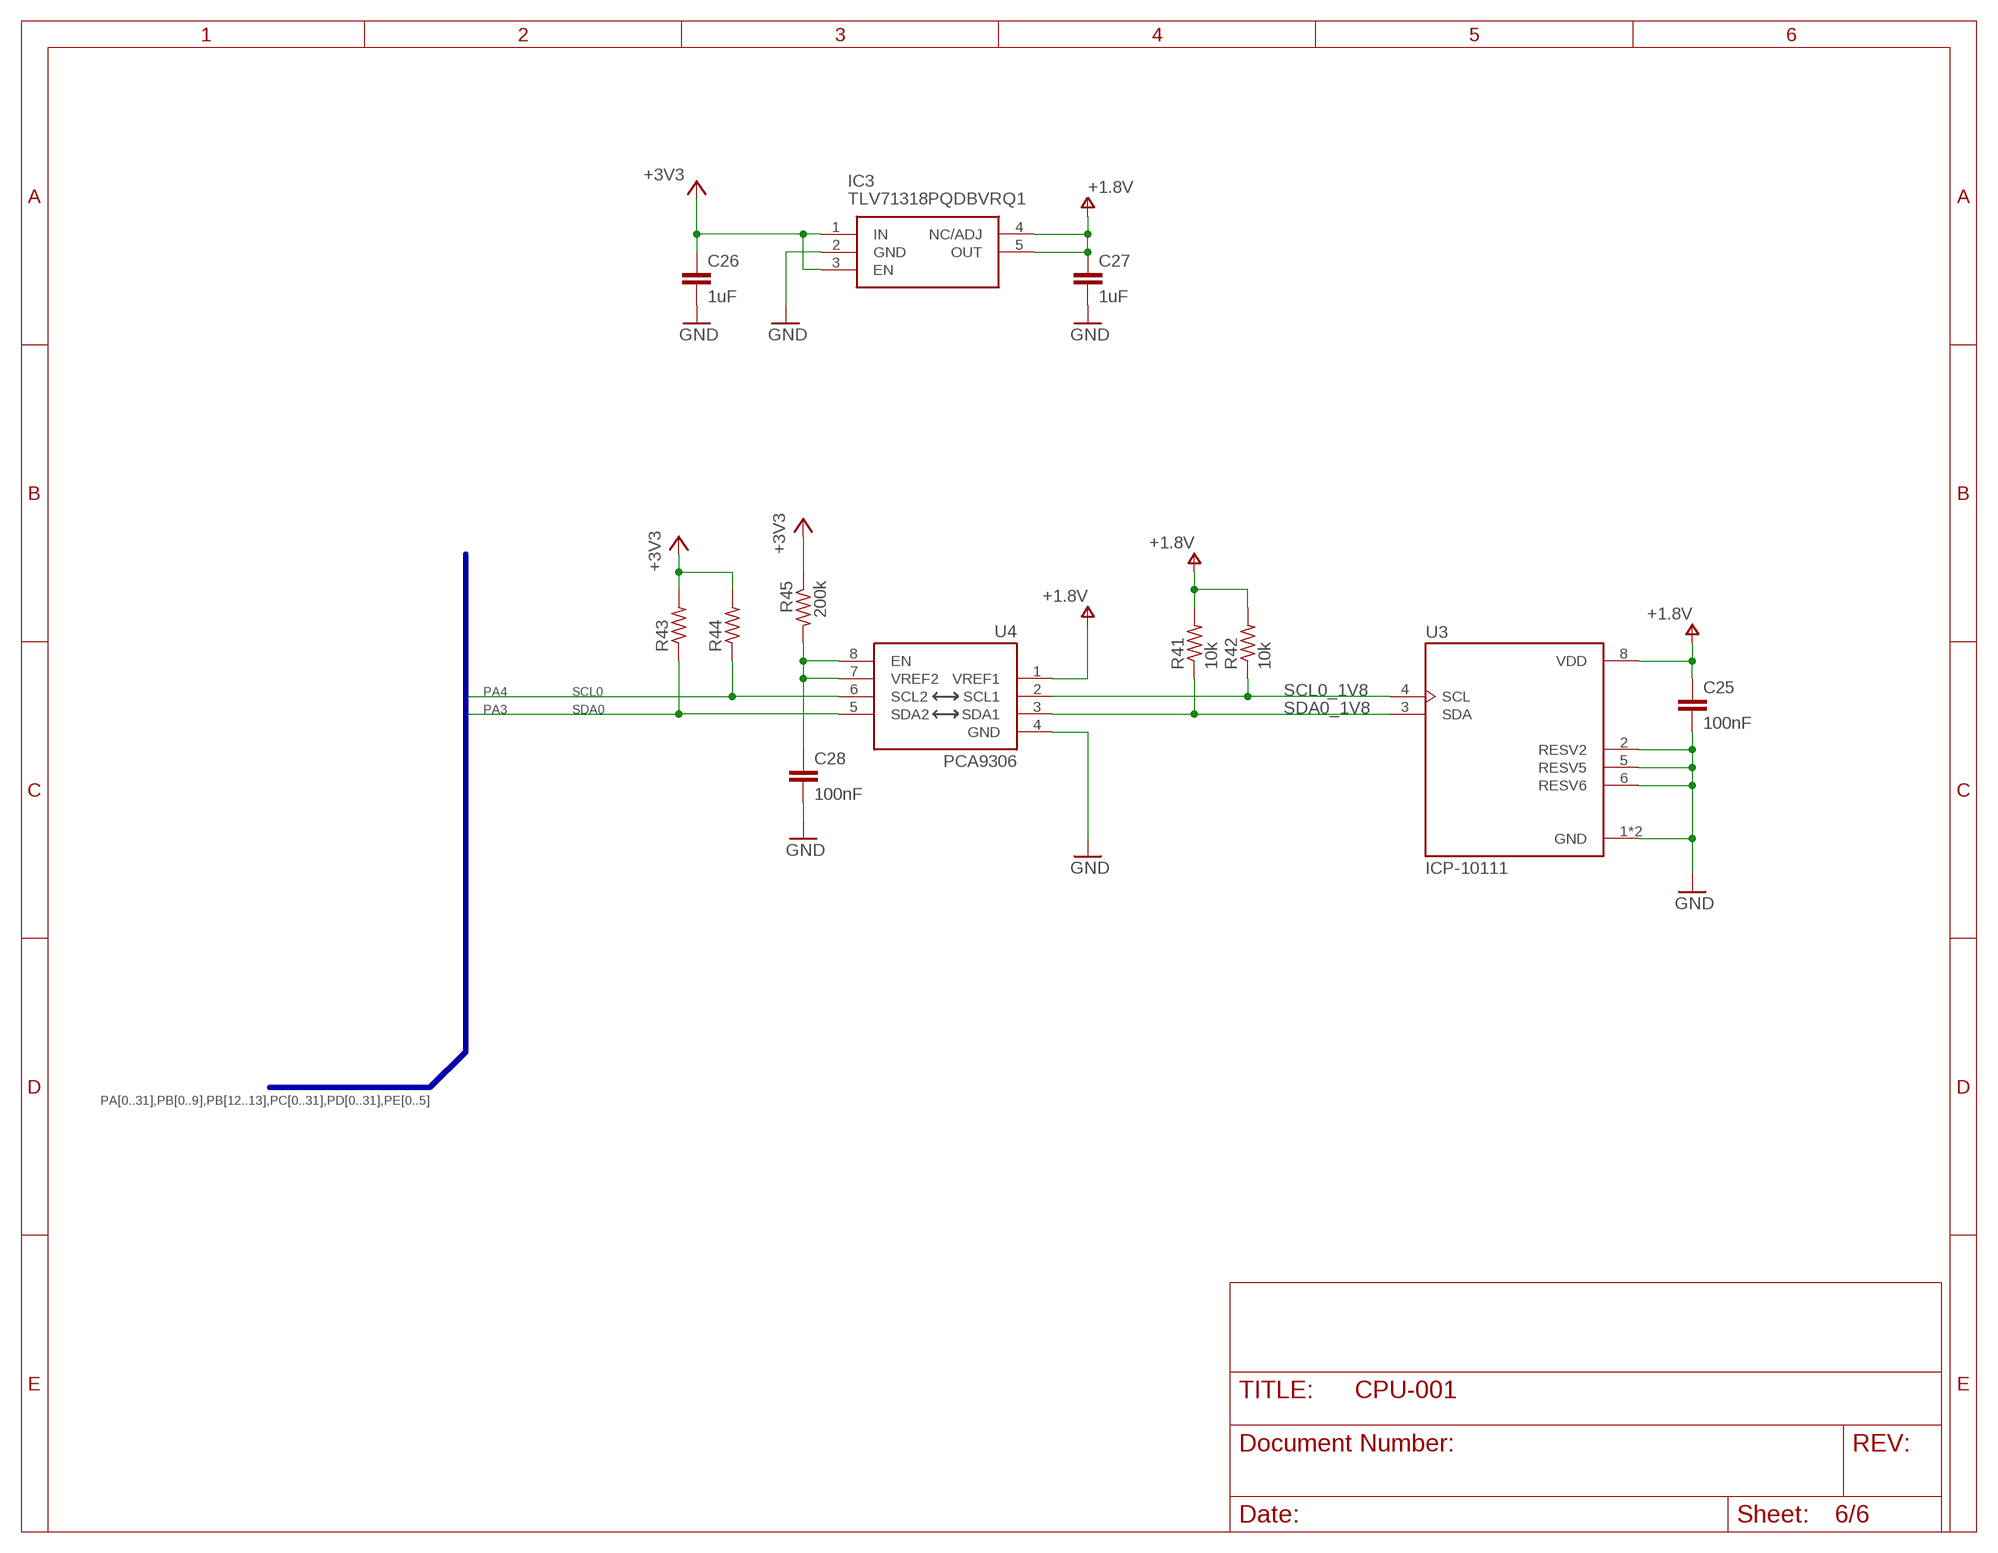
[diagram p5: schematic, sheet 6]

### Parts
C25  100nF  C-EUC0402  [C0402]
C26  1uF  C-EUC0402  [C0402]
C27  1uF  C-EUC0402  [C0402]
C28  100nF  C-EUC0402  [C0402]
IC3  TLV71318PQDBVRQ1  NCP718BSN180T1G  [SOT95P280X100-5N]
R41  10k  R-US_R0402  [R0402]
R42  10k  R-US_R0402  [R0402]
R43  R-US_R0402  [R0402]
R44  R-US_R0402  [R0402]
R45  200k  R-US_R0402  [R0402]
U3  ICP-10111  [PSON65P250X200X100-8N]
U4  PCA9306  PCA9306PCA9306DC-1:1  [PCA9306DC]

### Nets
+1.8V: C25.1 C27.1 IC3.4(NC/ADJ) IC3.5(OUT) R41.2 R42.2 U3.8(VDD) U4.1(VREF1)
+3V3: C26.1 IC3.1(IN) IC3.3(EN) R43.2 R44.2 R45.1 ; also sheet 1,2,4,5
GND: C25.2 C26.2 C27.2 C28.2 IC3.2(GND) U3.1(GND) U3.2(RESV2) U3.5(RESV5) U3.6(RESV6) U3.7(GND) U4.4(GND) ; also sheet 1,2,4,5
N$1: C28.1 R45.2 U4.7(VREF2) U4.8(EN)
PA3: R43.1 U4.5(SDA2) ; also sheet 3
PA4: R44.1 U4.6(SCL2) ; also sheet 3
SCL0_1V8: R42.1 U3.4(SCL) U4.2(SCL1)
SDA0_1V8: R41.1 U3.3(SDA) U4.3(SDA1)

### Buses
PA[0..31],PB[0..9],PB[12..13],PC[0..31],PD[0..31],PE[0..5]

### Notes on the sheet
- SCL0
- SDA0

## Power pins joined to a net without a drawn wire
VREFN: U1.8(C:VREFN)
VREFP: U1.9(C:VREFP)

## Library data of the parts
C1-C22 C25-C30 = rcl:C-EU: CAPACITOR, European symbol; SPICEPREFIX: C
C23 C24 = SparkFun-Capacitors:10UF-POLAR: 10.0µF polarized capacitors A capacitor is a passive two-terminal electrical component used to store electrical energy temporarily in an electric field.; PROD_ID: CAP-13210
IC1 = SamacSys Managed:IS42S16800F-7TL: ISSI IS42S16800F-7TL, SDRAM 128Mbit Surface Mount, 143MHz, 3 3.6 V, 54-Pin TSOP Source: Datasheet <https://componentsearchengine.com/Datasheets/1/IS42S16800F-7TL.pdf>; DESCRIPTION: ISSI IS42S16800F-7TL, SDRAM 128Mbit Surface Mount, 143MHz, 3 3.6 V, 54-Pin TSOP; HEIGHT: 1.2mm; MANUFACTURER_NAME: Integrated Silicon Solution Inc.; MANUFACTURER_PART_NUMBER: IS42S16800F-7TL; MOUSER_PART_NUMBER: 870-IS42S16800F-7TL; MOUSER_PRICE-STOCK: https://www.mouser.com/Search/Refine.aspx?Keyword=870-IS42S16800F-7TL
IC2 = v-reg:LD117A?*: Low drop fixed and adjustable positive voltage regulators 1 A Source: http://www.st.com/stonline/products/literature/ds/7194/ld1117axx.pdf
IC3 = SamacSys_Parts:NCP718BSN180T1G: 300 MA LOW IQ, WIDE INPUT Source: Datasheet <https://componentsearchengine.com/Datasheets/1/NCP718BSN180T1G.pdf>; DESCRIPTION: 300 MA LOW IQ, WIDE INPUT; HEIGHT: 1mm; MANUFACTURER_NAME: ON Semiconductor; MANUFACTURER_PART_NUMBER: NCP718BSN180T1G; MOUSER_PART_NUMBER: 863-NCP718BSN180T1G
J1 J3 = BergStak:10144517-04
J2 J4 = BergStak:10144518-04
J6 = Headers:2X5_0.05_SWD
L1 L2 = SparkFun-Coils:INDUCTOR: Inductors Resist changes in electrical current. Basically a coil of wire. SparkFun Products: SparkFun Load Cell Amplifier - HX711 <https://www.sparkfun.com/products/13879> IOIO-OTG - V2.2 <https://www.sparkfun.com/products/13613>; PROD_ID: NDUC-07874; VALUE: 33nH/±5%/500mA
R1-R45 R26999 R89999 = rcl:R-US_: RESISTOR, American symbol; SPICEPREFIX: R
U1 = ATSAM:ATSAMV71Q19B-AABT; MANUFACTURER_PART_NUMBER: ATSAMV71Q19BAABT; VENDOR: Microchip
U2 U7 = SamacSys Managed:ATA6561-GAQW-N: MICROCHIP - ATA6561-GAQW-N - CAN TRANSCEIVER, 5MBPS, -40 TO 150DEG C Source: Datasheet <https://componentsearchengine.com/Datasheets/1/ATA6561-GAQW-N.pdf>; DESCRIPTION: MICROCHIP - ATA6561-GAQW-N - CAN TRANSCEIVER, 5MBPS, -40 TO 150DEG C; HEIGHT: 1.75mm; MANUFACTURER_NAME: Microchip; MANUFACTURER_PART_NUMBER: ATA6561-GAQW-N; MOUSER_PART_NUMBER: 579-ATA6561-GAQW-N; MOUSER_PRICE-STOCK: https://www.mouser.com/Search/Refine.aspx?Keyword=579-ATA6561-GAQW-N
U3 = ICP-10111:ICP-10111: 6-Axis Ois/Eis Optimized Mems Sensor; DIGI-KEY_PART_NUMBER: 1428-1145-1-ND; DIGI-KEY_PURCHASE_URL: https://www.digikey.com/product-detail/en/tdk-invensense/ICP-10111/1428-1145-1-ND/9555757?utm_source=snapeda&utm_medium=aggregator&utm_campaign=symbol; MF: TDK InvenSense; MP: ICP-10111; PACKAGE: PSON-8 TDK-InvenSense
U4 = SparkFun-IC-Comms:PCA9306: Bidirectional I2C level shifter Not compatible with all available part number pinout schemes- DOUBLE CHECK!!! Datasheet <https://cdn.sparkfun.com/datasheets/BreakoutBoards/PCA9306DC.pdf> SparkFun Products SparkFun Inventor's Kit for RedBot <https://www.sparkfun.com/products/12649> (ROB-12649) SparkFun RedBot Basic Kit <https://www.sparkfun.com/products/13166> (ROB-13166) SparkFun Level Translator Breakout - PCA9306 <https://www.sparkfun.com/products/11955> (BOB-11955) SparkFun Block for Intel Edison - ADC <https://www.sparkfun.com/products/13770> (DEV-13770) SparkFun Block for Intel® Edison - Raspberry Pi B <https://www.sparkfun.com/products/13044> (DEV-13044) SparkFun RedBot Sensor - Accelerometer <https://www.sparkfun.com/products/12589> (SEN-12589); PROD_ID: IC-10023
U$5 = Connectors:MICROSD: Micro-SD / Transflash card holder with SPI pinout For the 3M # 2908-05WB-MG and/or 4UCON #19656 push-push type